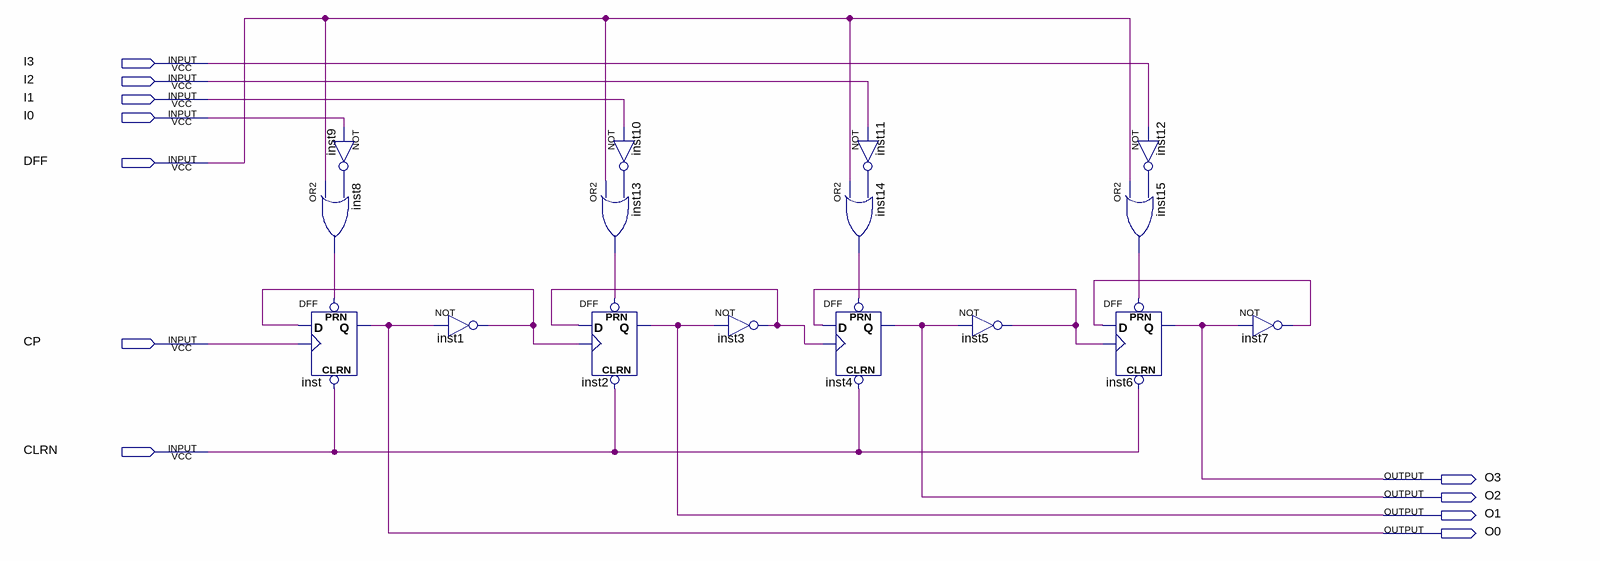
[diagram p0: schematic sheet]
// Quartus schematic counter_with_set_16.bdf as structural Verilog: 16 symbols, 11 pins
module counter_with_set_16 (
  input  I3,
  input  I2,
  input  I1,
  input  I0,
  input  DFF,
  input  CP,
  input  CLRN,
  output O3,
  output O2,
  output O1,
  output O0
);

  wire inst1_out, inst3_out, inst5_out, inst7_out, inst8_out, inst9_out, inst10_out, inst11_out, inst12_out,
       inst13_out, inst14_out, inst15_out;

  not inst9 (inst9_out, I0);
  or inst8 (inst8_out, DFF, inst9_out);
  DFF inst (.CLRN(CLRN), .CLK(CP), .D(inst1_out), .PRN(inst8_out), .Q(O0));
  not inst1 (inst1_out, O0);
  not inst10 (inst10_out, I1);
  or inst13 (inst13_out, DFF, inst10_out);
  DFF inst2 (.CLRN(CLRN), .CLK(inst1_out), .D(inst3_out), .PRN(inst13_out), .Q(O1));
  not inst3 (inst3_out, O1);
  not inst11 (inst11_out, I2);
  or inst14 (inst14_out, DFF, inst11_out);
  DFF inst4 (.CLRN(CLRN), .CLK(inst3_out), .D(inst5_out), .PRN(inst14_out), .Q(O2));
  not inst5 (inst5_out, O2);
  not inst12 (inst12_out, I3);
  or inst15 (inst15_out, DFF, inst12_out);
  DFF inst6 (.CLRN(CLRN), .CLK(inst5_out), .D(inst7_out), .PRN(inst15_out), .Q(O3));
  not inst7 (inst7_out, O3);
endmodule
